# Altium schematic sheet [1] TableOfContents.SchDoc: =DocumentName
size A3; Organization: ORGANIZATION; Address1: R. Aprígio Veloso, 882, Universitário; Address2: Campina Grande - PB; Address3: 58429-900; DocumentNumber: 1; Revision: -; SheetNumber: 1; SheetTotal: 8; ENG_DATE: --/--/--; DSN_DATE: --/--/--; CHK_DATE: --/--/--; SCH_SCALE: 1:1
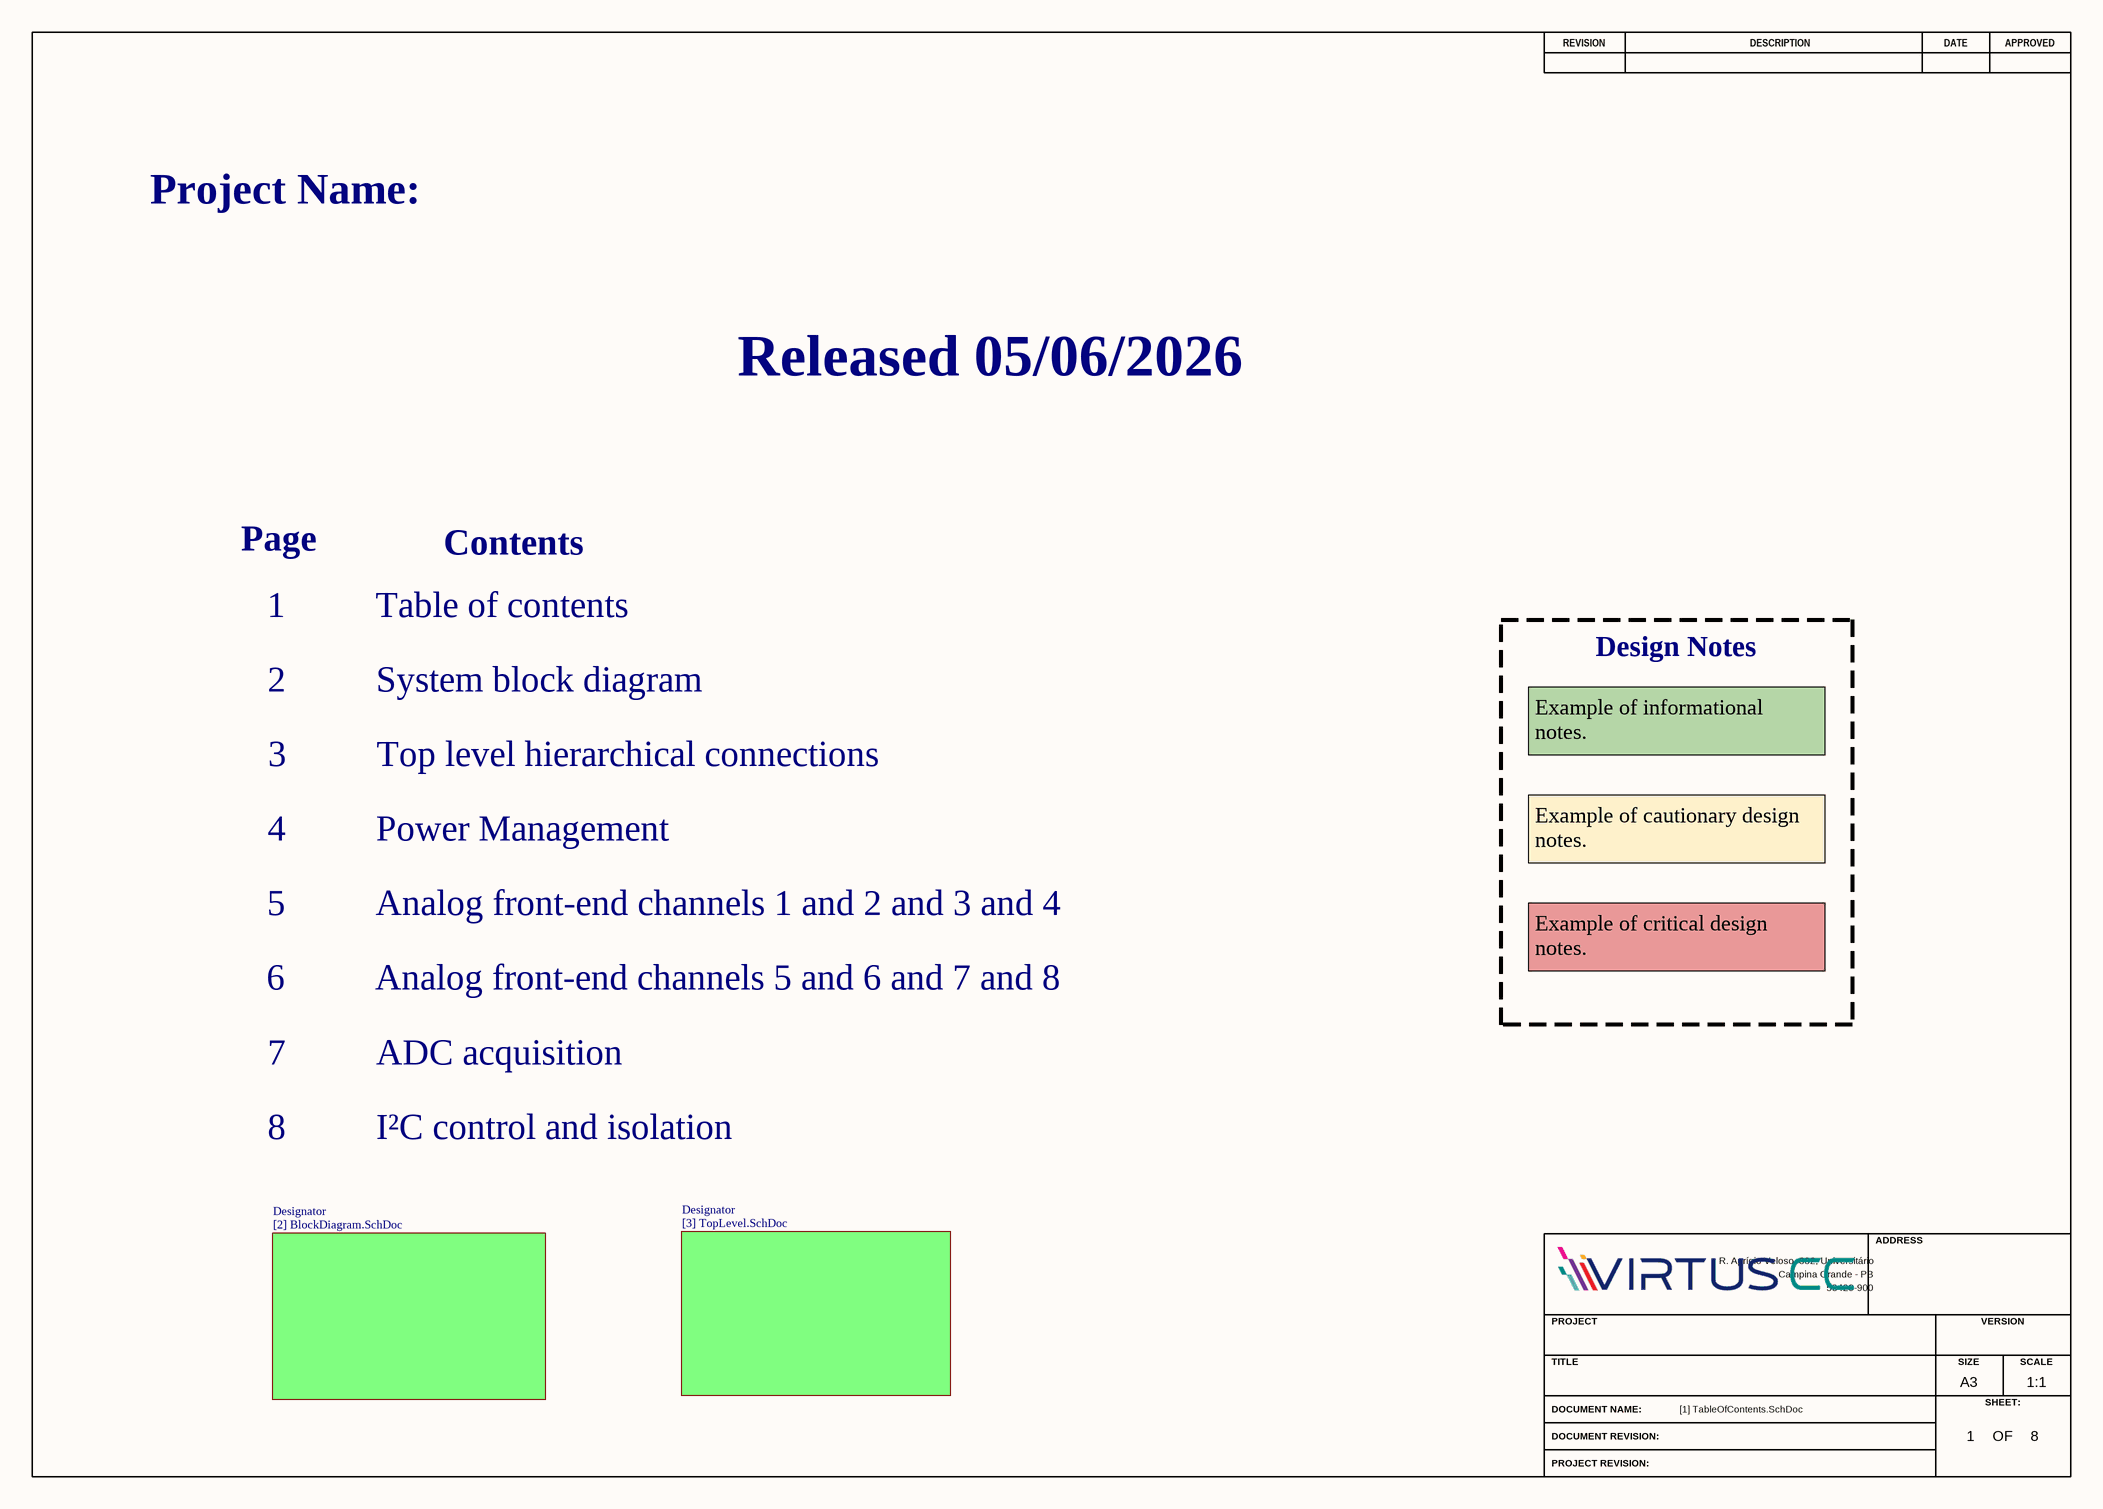
[diagram p0: [1] TableOfContents.SchDoc]

## Sub-sheets
Designator = [2] BlockDiagram.SchDoc: no entries
Designator = [3] TopLevel.SchDoc: no entries

## Notes on the sheet
- Project Name:
- Released 05/06/2026
- Page
- Contents
- 1          Table of contents
- Design Notes
- 2          System block diagram
- 3          Top level hierarchical connections
- Example of informational notes.
- 4          Power Management
- Example of cautionary design notes.
- 5          Analog front-end channels 1 and 2 and 3 and 4
- 6          Analog front-end channels 5 and 6 and 7 and 8
- Example of critical design notes.
- 7          ADC acquisition
- 8          I²C control and isolation
- REVISION
- DESCRIPTION
- DATE
- APPROVED
- ADDRESS
- PROJECT
- VERSION
- TITLE
- A3
- SIZE
- SCALE
- DOCUMENT NAME:
- DOCUMENT REVISION:
- OF
- SHEET:
- PROJECT REVISION: